# Altium schematic sheet TOP.SchDoc: TOP
size A3; Author: SS; SheetNumber: 1
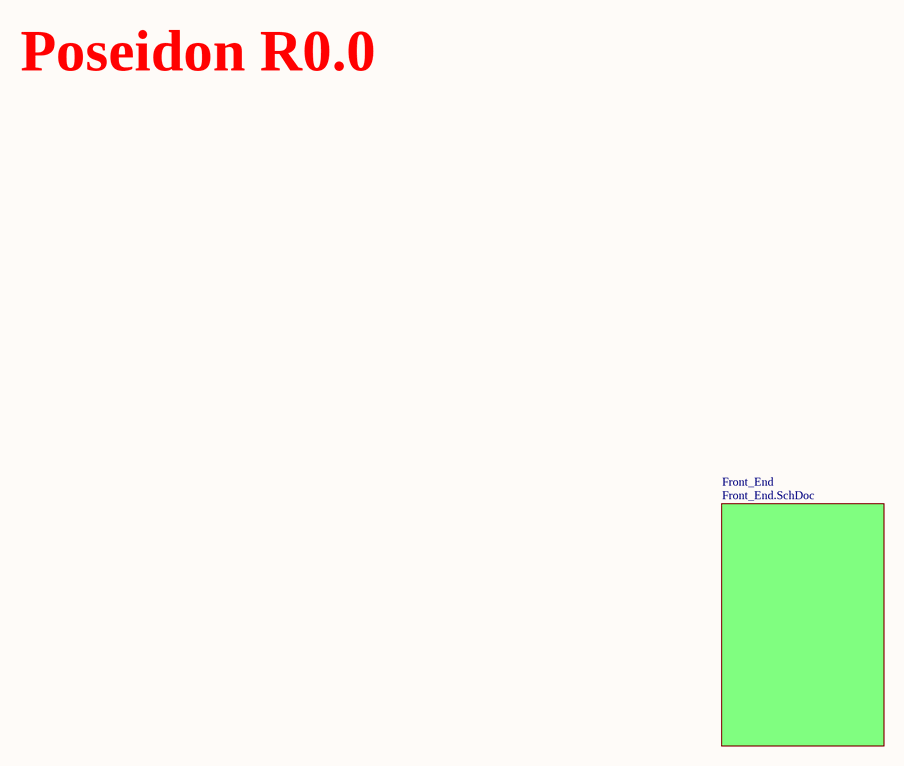
[diagram p0: TOP.SchDoc]

## Sub-sheets
Front_End = Front_End.SchDoc: no entries

## Notes on the sheet
- Poseidon R0.0
- Size:
- (...)
- A3
- Title:
- Sheet
- of
- Author: